# EAGLE schematic ATTEMP-Schematic (EAGLE 7.2.0)
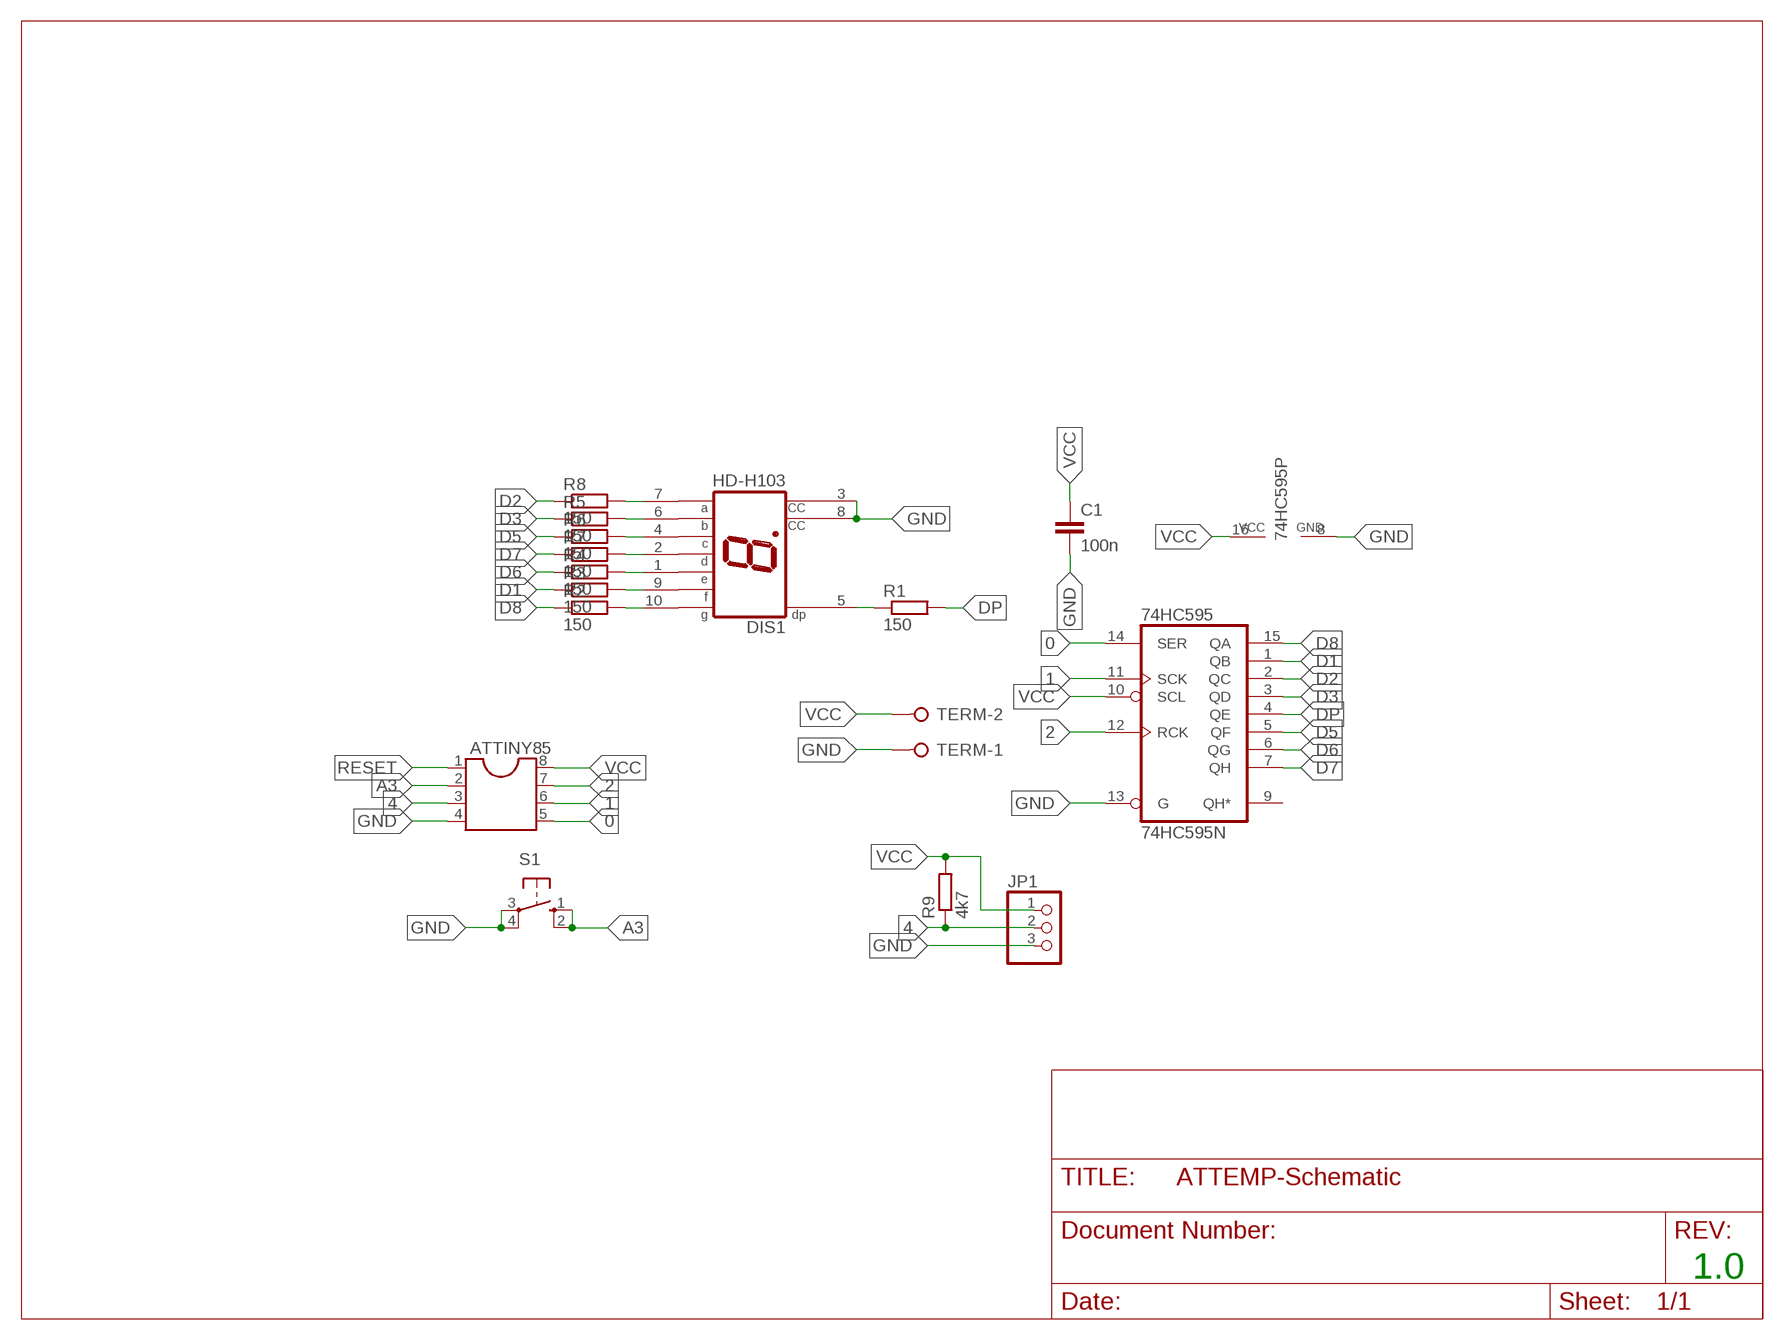
[diagram p0: schematic, sheet 1]

## Parts
74HC595  74HC595N  [DIL16]
ATTINY85  DIL8  [DIL08]
C1  100n  C-EUC1206  [C1206]
DIS1  HD-H103  [HDSP-M]
JP1  PINHD-1X3  [1X03]
R1  150  R-EU_R1206  [R1206]
R2  150  R-EU_R1206  [R1206]
R3  150  R-EU_R1206  [R1206]
R4  150  R-EU_R1206  [R1206]
R5  150  R-EU_R1206  [R1206]
R6  150  R-EU_R1206  [R1206]
R7  150  R-EU_R1206  [R1206]
R8  150  R-EU_R1206  [R1206]
R9  4k7  R-EU_R1206  [R1206]
S1  10-XX  [B3F-10XX]
TERM  W237-02P  [W237-132]

## Nets
0: 74HC595.14(SER) ATTINY85.5
1: 74HC595.11(SCK) ATTINY85.6
2: 74HC595.12(RCK) ATTINY85.7
4: ATTINY85.3 JP1.2 R9.1
A3: ATTINY85.2 S1.1(S) S1.2(S1)
D1: 74HC595.1(QB) R3.1
D2: 74HC595.2(QC) R8.1
D3: 74HC595.3(QD) R5.1
D5: 74HC595.5(QF) R6.1
D6: 74HC595.6(QG) R4.1
D7: 74HC595.7(QH) R7.1
D8: 74HC595.15(QA) R2.1
DP: 74HC595.4(QE) R1.2
GND: 74HC595.8(GND) 74HC595.13(G) ATTINY85.4 C1.2 DIS1.3(CC) DIS1.8(CC) JP1.3 S1.3(P) S1.4(P1) TERM.1
N$1: DIS1.7(A) R8.2
N$2: DIS1.6(B) R5.2
N$3: DIS1.4(C) R6.2
N$4: DIS1.2(D) R7.2
N$5: DIS1.1(E) R4.2
N$6: DIS1.9(F) R3.2
N$7: DIS1.10(G) R2.2
N$8: DIS1.5(DP) R1.1
RESET: ATTINY85.1
VCC: 74HC595.10(SCL) 74HC595.16(VCC) ATTINY85.8 C1.1 JP1.1 R9.2 TERM.2
Unconnected: 74HC595.9(QH*)

## Notes on the sheet
- 1.0

## Library data of the parts
74HC595 = 74xx-eu:74*595: 8-bit SHIFT REGISTER, output latch
ATTINY85 = ic-package:DIL8: Dual In Line / Socket
C1 = rcl:C-EU: CAPACITOR, European symbol
DIS1 = display-hp:HD-H103: LED DISPLAY 1-character 7 segment, decimal point right; OC_FARNELL: unknown; OC_NEWARK: unknown
JP1 = pinhead:PINHD-1X3: PIN HEADER
R1-R9 = rcl:R-EU_: RESISTOR, European symbol
S1 = switch-omron:10-XX: OMRON SWITCH; MPN: B3F-1000; OC_FARNELL: 176432; OC_NEWARK: 36M3542
TERM = con-wago-508:W237-02P: WAGO SREW CLAMP; OC_FARNELL: unknown; OC_NEWARK: unknown